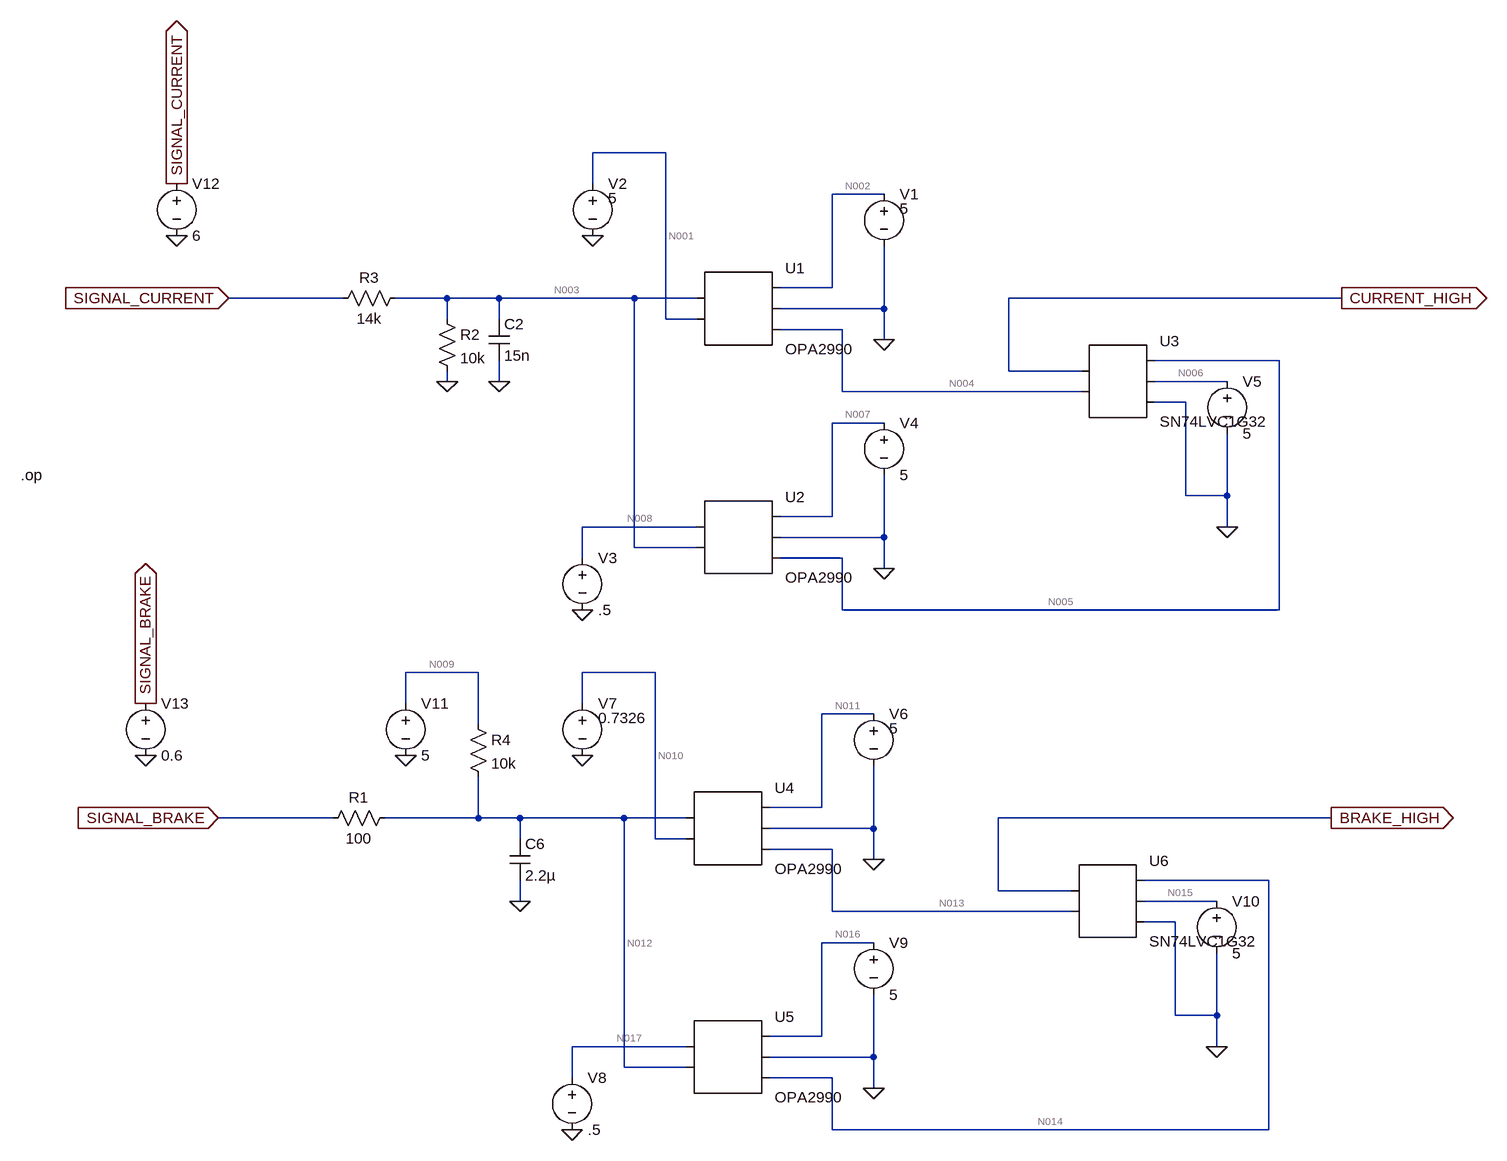
[diagram p0: schematic BSPD.asc]
BSPD.asc, the LTspice schematic file:
Version 4
SHEET 1 1588 1584
WIRE 336 64 224 64
WIRE 224 112 224 64
WIRE 672 128 592 128
WIRE 592 272 592 128
WIRE 592 272 512 272
WIRE -160 288 -336 288
WIRE 0 288 -80 288
WIRE 80 288 0 288
WIRE 288 288 80 288
WIRE 384 288 288 288
WIRE 1376 288 864 288
WIRE 672 304 672 208
WIRE 672 304 512 304
WIRE 0 320 0 288
WIRE 80 320 80 288
WIRE 336 320 336 64
WIRE 384 320 336 320
WIRE 608 336 512 336
WIRE 672 352 672 304
WIRE 1280 384 1088 384
WIRE 864 400 864 288
WIRE 976 400 864 400
WIRE 0 416 0 400
WIRE 80 416 80 384
WIRE 1200 416 1088 416
WIRE 608 432 608 336
WIRE 976 432 608 432
WIRE 1136 448 1088 448
WIRE 672 480 592 480
WIRE 1136 592 1136 448
WIRE 1200 592 1200 496
WIRE 1200 592 1136 592
WIRE 592 624 592 480
WIRE 592 624 512 624
WIRE 384 640 208 640
WIRE 1200 640 1200 592
WIRE 672 656 672 560
WIRE 672 656 512 656
WIRE 288 672 288 288
WIRE 384 672 288 672
WIRE 208 688 208 640
WIRE 608 688 512 688
WIRE 672 704 672 656
WIRE 608 768 608 688
WIRE 1280 768 1280 384
WIRE 1280 768 608 768
WIRE 48 864 -64 864
WIRE 320 864 208 864
WIRE -64 912 -64 864
WIRE 208 912 208 864
WIRE 656 928 576 928
WIRE 48 944 48 864
WIRE 576 1072 576 928
WIRE 576 1072 496 1072
WIRE -176 1088 -352 1088
WIRE 48 1088 48 1024
WIRE 48 1088 -96 1088
WIRE 112 1088 48 1088
WIRE 272 1088 112 1088
WIRE 368 1088 272 1088
WIRE 1360 1088 848 1088
WIRE 656 1104 656 1008
WIRE 656 1104 496 1104
WIRE 112 1120 112 1088
WIRE 320 1120 320 864
WIRE 368 1120 320 1120
WIRE 592 1136 496 1136
WIRE 656 1152 656 1104
WIRE 1264 1184 1072 1184
WIRE 848 1200 848 1088
WIRE 960 1200 848 1200
WIRE 112 1216 112 1184
WIRE 1184 1216 1072 1216
WIRE 592 1232 592 1136
WIRE 960 1232 592 1232
WIRE 1120 1248 1072 1248
WIRE 656 1280 576 1280
WIRE 1120 1392 1120 1248
WIRE 1184 1392 1184 1296
WIRE 1184 1392 1120 1392
WIRE 576 1424 576 1280
WIRE 576 1424 496 1424
WIRE 368 1440 192 1440
WIRE 1184 1440 1184 1392
WIRE 656 1456 656 1360
WIRE 656 1456 496 1456
WIRE 272 1472 272 1088
WIRE 368 1472 272 1472
WIRE 192 1488 192 1440
WIRE 592 1488 496 1488
WIRE 656 1504 656 1456
WIRE 592 1568 592 1488
WIRE 1264 1568 1264 1184
WIRE 1264 1568 592 1568
FLAG 672 352 0
FLAG 80 416 0
FLAG 0 416 0
FLAG 672 704 0
FLAG 1200 640 0
FLAG 224 192 0
FLAG 208 768 0
FLAG 656 1152 0
FLAG 112 1216 0
FLAG 656 1504 0
FLAG 1184 1440 0
FLAG 208 992 0
FLAG 192 1568 0
FLAG -64 992 0
FLAG -336 288 SIGNAL_CURRENT
IOPIN -336 288 In
FLAG -352 1088 SIGNAL_BRAKE
IOPIN -352 1088 In
FLAG 1376 288 CURRENT_HIGH
IOPIN 1376 288 Out
FLAG 1360 1088 BRAKE_HIGH
IOPIN 1360 1088 Out
FLAG -416 192 0
FLAG -416 112 SIGNAL_CURRENT
IOPIN -416 112 Out
FLAG -464 992 0
FLAG -464 912 SIGNAL_BRAKE
IOPIN -464 912 Out
SYMBOL AutoGenerated/OPA2990 448 304 R0
SYMATTR InstName U1
SYMBOL voltage 672 112 R0
WINDOW 3 24 38 Left 2
SYMATTR Value 5
SYMATTR InstName V1
SYMBOL voltage 224 96 R0
WINDOW 3 24 38 Left 2
SYMATTR Value 5
SYMATTR InstName V2
SYMBOL res -64 272 R90
WINDOW 0 0 56 VBottom 2
WINDOW 3 32 56 VTop 2
SYMATTR InstName R3
SYMATTR Value 14k
SYMBOL cap 64 320 R0
SYMATTR InstName C2
SYMATTR Value 15n
SYMBOL voltage 208 672 R0
SYMATTR InstName V3
SYMATTR Value .5
SYMBOL AutoGenerated/OPA2990 448 656 R0
SYMATTR InstName U2
SYMBOL voltage 672 464 R0
SYMATTR InstName V4
SYMATTR Value 5
SYMBOL AutoGenerated/SN74LVC1G32 1024 416 R0
SYMATTR InstName U3
SYMBOL voltage 1200 400 R0
SYMATTR InstName V5
SYMATTR Value 5
SYMBOL AutoGenerated/OPA2990 432 1104 R0
SYMATTR InstName U4
SYMBOL voltage 656 912 R0
WINDOW 3 24 38 Left 2
SYMATTR Value 5
SYMATTR InstName V6
SYMBOL voltage 208 896 R0
WINDOW 3 24 38 Left 2
SYMATTR Value 0.7326
SYMATTR InstName V7
SYMBOL res -80 1072 R90
WINDOW 0 0 56 VBottom 2
WINDOW 3 32 56 VTop 2
SYMATTR InstName R1
SYMATTR Value 100
SYMBOL cap 96 1120 R0
SYMATTR InstName C6
SYMATTR Value 2.2µ
SYMBOL voltage 192 1472 R0
SYMATTR InstName V8
SYMATTR Value .5
SYMBOL AutoGenerated/OPA2990 432 1456 R0
SYMATTR InstName U5
SYMBOL voltage 656 1264 R0
SYMATTR InstName V9
SYMATTR Value 5
SYMBOL AutoGenerated/SN74LVC1G32 1008 1216 R0
SYMATTR InstName U6
SYMBOL voltage 1184 1200 R0
SYMATTR InstName V10
SYMATTR Value 5
SYMBOL voltage -64 896 R0
SYMATTR InstName V11
SYMATTR Value 5
SYMBOL voltage -416 96 R0
SYMATTR InstName V12
SYMATTR Value 6
SYMBOL res -16 304 R0
SYMATTR InstName R2
SYMATTR Value 10k
SYMBOL voltage -464 896 R0
SYMATTR InstName V13
SYMATTR Value 0.6
SYMBOL res 32 928 R0
SYMATTR InstName R4
SYMATTR Value 10k
TEXT -656 560 Left 2 !.op

The netlist it stands for:
* BSPD.asc
* U1: OPA2990 (symbol AutoGenerated/OPA2990 not available, pins judged from their places): pin1=N003 pin2=N001 pin3=N002 pin4=0 pin5=N004
V1 N002 0 5
V2 N001 0 5
R3 N003 SIGNAL_CURRENT 14k
C2 N003 0 15n
V3 N008 0 .5
* U2: OPA2990 (symbol AutoGenerated/OPA2990 not available, pins judged from their places): pin1=N008 pin2=N003 pin3=N007 pin4=0 pin5=N005
V4 N007 0 5
* U3: SN74LVC1G32 (symbol AutoGenerated/SN74LVC1G32 not available, pins judged from their places): pin1=CURRENT_HIGH pin2=N004 pin3=N005 pin4=N006 pin5=0
V5 N006 0 5
* U4: OPA2990 (symbol AutoGenerated/OPA2990 not available, pins judged from their places): pin1=N012 pin2=N010 pin3=N011 pin4=0 pin5=N013
V6 N011 0 5
V7 N010 0 0.7326
R1 N012 SIGNAL_BRAKE 100
C6 N012 0 2.2µ
V8 N017 0 .5
* U5: OPA2990 (symbol AutoGenerated/OPA2990 not available, pins judged from their places): pin1=N017 pin2=N012 pin3=N016 pin4=0 pin5=N014
V9 N016 0 5
* U6: SN74LVC1G32 (symbol AutoGenerated/SN74LVC1G32 not available, pins judged from their places): pin1=BRAKE_HIGH pin2=N013 pin3=N014 pin4=N015 pin5=0
V10 N015 0 5
V11 N009 0 5
V12 SIGNAL_CURRENT 0 6
R2 N003 0 10k
V13 SIGNAL_BRAKE 0 0.6
R4 N009 N012 10k
.op
.backanno
.end

* Results of the author's LTspice run, read from the files saved beside the schematic
* Operating Point:
*   V(n004) = 46.38 mV
*   V(n002) = 5 V
*   V(n001) = 5 V
*   V(n003) = 2.5 V
*   V(signal_current) = 6 V
*   V(n008) = 500 mV
*   V(n005) = 46.38 mV
*   V(n007) = 5 V
*   V(n006) = 5 V
*   V(current_high) = 0 V
*   V(n013) = 47.87 mV
*   V(n011) = 5 V
*   V(n010) = 732.6 mV
*   V(n012) = 643.6 mV
*   V(signal_brake) = 600 mV
*   V(n017) = 500 mV
*   V(n014) = 47.74 mV
*   V(n016) = 5 V
*   V(n015) = 5 V
*   V(brake_high) = 0 V
*   V(n009) = 5 V
*   I(C6) = 0 A
*   I(C2) = 0 A
*   I(R4) = 435.6 µA
*   I(R2) = 250 µA
*   I(R1) = 435.6 µA
*   I(R3) = -250 µA
*   I(V13) = 435.6 µA
*   I(V12) = -250 µA
*   I(V11) = -435.6 µA
*   I(V10) = -333.3 nA
*   I(V9) = -120 µA
*   I(V8) = -2.537 pA
*   I(V7) = 1.236 pA
*   I(V6) = -120 µA
*   I(V5) = -333.3 nA
*   I(V4) = -120 µA
*   I(V3) = -2.551 pA
*   I(V2) = -20.58 pA
*   I(V1) = -120 µA